# EAGLE schematic pick&place (EAGLE 9.4.2)
CNAME: Pick&Place; CREVISION: 1.0 - 032021; DESIGNER: Mauro Alfieri
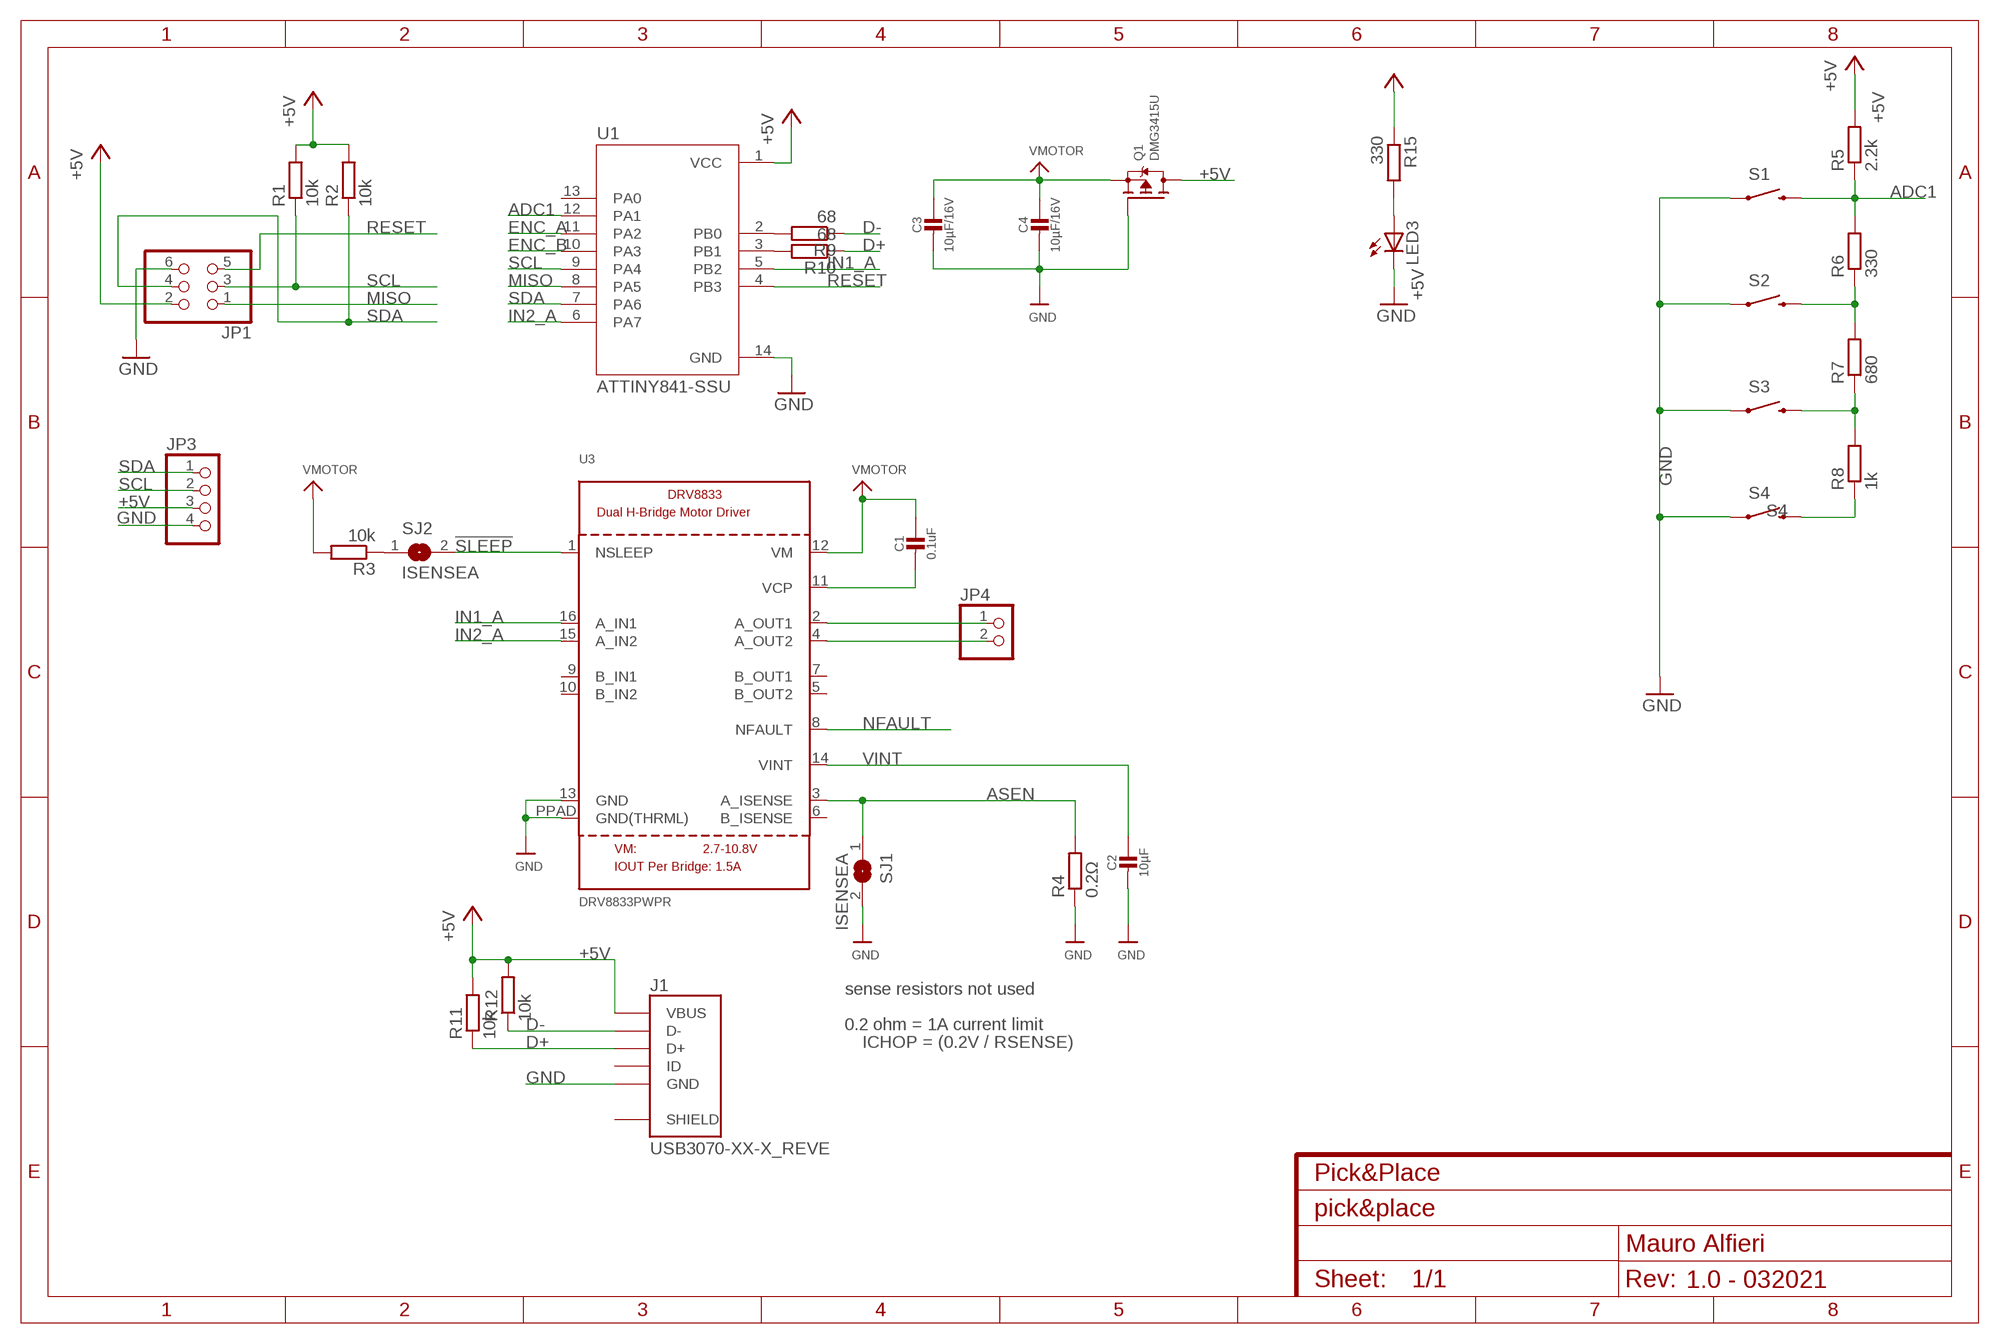
[diagram p0: schematic, sheet 1]

## Parts
C1  0.1uF  CAP_CERAMIC0805-NOOUTLINE  [0805-NO]
C2  10µF  CAP_CERAMIC0805-NOOUTLINE  [0805-NO]
C3  10µF/16V  CAP_CERAMIC0805-NOOUTLINE  [0805-NO]
C4  10µF/16V  CAP_CERAMIC0805-NOOUTLINE  [0805-NO]
J1  USB3070-XX-X_REVE  [GCT_USB3070-XX-X_REVE]
JP1  PINHD-2X3  [2X03]
JP3  HEADER-1X4ROUND  [1X04_ROUND]
JP4  HEADER-1X2ROUND  [1X02_ROUND]
LED3  LEDSML0805  [SML0805]
Q1  DMG3415U  MOSFET-PWIDE  [SOT23-WIDE]
R1  10k  R-EU_R0805  [R0805]
R2  10k  R-EU_R0805  [R0805]
R3  10k  R-EU_R0805  [R0805]
R4  0.2Ω  R-EU_R0805  [R0805]
R5  2.2k  R-EU_R0805  [R0805]
R6  330  R-EU_R0805  [R0805]
R7  680  R-EU_R0805  [R0805]
R8  1k  R-EU_R0805  [R0805]
R9  68  R-EU_R0805  [R0805]
R10  68  R-EU_R0805  [R0805]
R11  10k  R-EU_R0805  [R0805]
R12  10k  R-EU_R0805  [R0805]
R15  330  R-EU_R0805  [R0805]
S1  Forward  SWITCH-MOMENTARY-2-SMD-1101NE  [TACTILE-SWITCH-1101NE]
S2  Backward  SWITCH-MOMENTARY-2-SMD-1101NE  [TACTILE-SWITCH-1101NE]
S3  Config  SWITCH-MOMENTARY-2-SMD-1101NE  [TACTILE-SWITCH-1101NE]
S4  SWITCH-MOMENTARY-2-SMD-1101NE  [TACTILE-SWITCH-1101NE]
SJ1  ISENSEA  SOLDERJUMPER  [SOLDERJUMPER_ARROW_NOPASTE]
SJ2  ISENSEA  SOLDERJUMPER  [SOLDERJUMPER_ARROW_NOPASTE]
U1  ATTINY841-SSU  [SOIC127P599X175-14N]
U3  DRV8833PWPR  DRV8833  [HTSSOP16]

## Nets
!SLEEP: SJ2.2 U3.1(NSLEEP)
+5V: J1.1(VBUS) JP1.2 JP3.3 Q1.3(D) R1.2 R2.2 R5.2 R11.2 R12.2 R15.1 U1.1(VCC)
ADC1: R5.1 R6.2 S1.P$2 U1.12(PA1)
AOUT1: JP4.1 U3.2(A_OUT1)
AOUT2: JP4.2 U3.4(A_OUT2)
ASEN: R4.2 SJ1.1 U3.3(A_ISENSE)
D+: J1.3(D+) R10.1 R11.1
D-: J1.2(D-) R9.1 R12.1
ENC_A: U1.11(PA2)
ENC_B: U1.10(PA3)
GND: C2.2 C3.2 C4.2 J1.5(GND) JP1.6 JP3.4 LED3.C Q1.1(G) R4.1 S1.P$1 S2.P$1 S3.P$1 S4.P$1 SJ1.2 U1.14(GND) U3.13(GND) U3.PPAD(GND(THRML))
IN1_A: U1.5(PB2) U3.16(A_IN1)
IN2_A: U1.6(PA7) U3.15(A_IN2)
MISO: JP1.1 U1.8(PA5)
N$1: R3.1 SJ2.1
N$3: R9.2 U1.2(PB0)
N$4: R10.2 U1.3(PB1)
N$8: C1.2 U3.11(VCP)
N$9: R7.1 R8.2 S3.P$2
N$12: LED3.A R15.2
N$14: R6.1 R7.2 S2.P$2
NFAULT: U3.8(NFAULT)
RESET: JP1.5 U1.4(PB3)
S4: R8.1 S4.P$2
SCL: JP1.3 JP3.2 R1.1 U1.9(PA4)
SDA: JP1.4 JP3.1 R2.1 U1.7(PA6)
VINT: C2.1 U3.14(VINT)
VMOTOR: C1.1 C3.1 C4.1 Q1.2(S) R3.2 U3.12(VM)
Unconnected: J1.4(ID) U1.13(PA0) U3.5(B_OUT2) U3.6(B_ISENSE) U3.7(B_OUT1) U3.9(B_IN1) U3.10(B_IN2)

## Notes on the sheet
- sense resistors not used
- 0.2 ohm = 1A current limit
- ICHOP = (0.2V / RSENSE)

## Power pins joined to a net without a drawn wire
SHIELD: J1.6(SHIELD) J1.7(SHIELD)

## Library data of the parts
C1-C4 = microbuilder:CAP_CERAMIC: Ceramic Capacitors For new designs, use the packages preceded by an '_' character since they are more reliable: The following footprints should be used on most boards: _0402 - Standard footprint for regular board layouts _0603 - Standard footprint for regular board layouts _0805 - Standard footprint for regular board layouts _1206 - Standard footprint for regular board layouts For extremely tight-pitch boards where space is at a premium, the following 'micro-pitch' footprints can be used (smaller pads, no silkscreen outline, etc.): _0402MP - Micro-pitch footprint for very dense/compact boards _0603MP - Micro-pitch footprint for very dense/compact boards _0805MP - Micro-pitch footprint for very dense/compact boards _1206MP - Micro-pitch footprint for very dense/compact boards
J1 = USB3070-XX-X_REVE:USB3070-XX-X_REVE: Micro USB Receptacle, Type B, Mid-Mount SMT, Right Angled, Bottom Mount, 1.0mm Offset, without Peg Check prices <https://pricing.snapeda.com/parts/USB3070-30-A/Global%20Connector%20Technology/view-part?ref=eda>; AVAILABILITY: Warning; DESCRIPTION: USB - micro B USB 2.0 Receptacle Connector 5 Position Board Edge, Cutout; Surface Mount, Right Angle; MF: Global Connector Technology; MP: USB3070-30-A; PACKAGE: None; PRICE: None; PURCHASE-URL: https://pricing.snapeda.com/search/part/USB3070-30-A/?ref=eda
JP1 = SparkFun:PINHD-2X3: PIN HEADER
JP3 = microbuilder:HEADER-1X4: PIN HEADER
JP4 = microbuilder:HEADER-1X2: PIN HEADER
LED3 = led:LED: LED OSRAM: - CHIPLED LG R971, LG N971, LY N971, LG Q971, LY Q971, LO R971, LY R971 LH N974, LH R974 LS Q976, LO Q976, LY Q976 LO Q996 - Hyper CHIPLED LW Q18S LB Q993, LB Q99A, LB R99A - SideLED LS A670, LO A670, LY A670, LG A670, LP A670 LB A673, LV A673, LT A673, LW A673 LH A674 LY A675 LS A676, LA A676, LO A676, LY A676, LW A676 LS A679, LY A679, LG A679 - Hyper Micro SIDELED® LS Y876, LA Y876, LO Y876, LY Y876 LT Y87S - SmartLED LW L88C, LW L88S LB L89C, LB L89S, LG L890 LS L89K, LO L89K, LY L89K LS L896, LA L896, LO L896, LY L896 - TOPLED LS T670, LO T670, LY T670, LG T670, LP T670 LSG T670, LSP T670, LSY T670, LOP T670, LYG T670 LG T671, LOG T671, LSG T671 LB T673, LV T673, LT T673, LW T673 LH T674 LS T676, LA T676, LO T676, LY T676, LB T676, LH T676, LSB T676, LW T676 LB T67C, LV T67C, LT T67C, LS T67K, LO T67K, LY T67K, LW E67C LS E67B, LA E67B, LO E67B, LY E67B, LB E67C, LV E67C, LT E67C LW T67C LS T679, LY T679, LG T679 LS T770, LO T770, LY T770, LG T770, LP T770 LB T773, LV T773, LT T773, LW T773 LH T774 LS E675, LA E675, LY E675, LS T675 LS T776, LA T776, LO T776, LY T776, LB T776 LHGB T686 LT T68C, LB T68C - Hyper Mini TOPLED® LB M676 - Mini TOPLED Santana® LG M470 LS M47K, LO M47K, LY M47K Source: http://www.osram.convergy.de LUXEON: - LUMILED® LXK2-PW12-R00, LXK2-PW12-S00, LXK2-PW14-U00, LXK2-PW14-V00 LXK2-PM12-R00, LXK2-PM12-S00, LXK2-PM14-U00 LXK2-PE12-Q00, LXK2-PE12-R00, LXK2-PE12-S00, LXK2-PE14-T00, LXK2-PE14-U00 LXK2-PB12-K00, LXK2-PB12-L00, LXK2-PB12-M00, LXK2-PB14-N00, LXK2-PB14-P00, LXK2-PB14-Q00 LXK2-PR12-L00, LXK2-PR12-M00, LXK2-PR14-Q00, LXK2-PR14-R00 LXK2-PD12-Q00, LXK2-PD12-R00, LXK2-PD12-S00 LXK2-PH12-R00, LXK2-PH12-S00 LXK2-PL12-P00, LXK2-PL12-Q00, LXK2-PL12-R00 Source: www.luxeon.com KINGBRIGHT: KA-3528ASYC Source: www.kingbright.com
Q1 = microbuilder:MOSFET-P: P-Channel Mosfet LEGEND VDS: Voltage Drain-Source ID: Drain Current RDS(ON): Drain-Source On-State Resistance VGS(TH): Gate-Source Threshold Voltage CISS: Drain-Source Input Capacitance SOT-23 Name VDS ID RDS(ON) VGS(TH) CISS Order Number IRLML5103 30V 760mA 600 mOhm -- 75pF @ 25V Digikey: IRLML5103PBFCT-ND IRLML6401 12V 4.3A 50 mOhm 950mV @ 250µA 830pF @ 10V Digikey: IRLML6401PBFTR-ND NTR0202PL 20V 400mA 800 mOhm 2.3V @ 250uA 70pF @ 5V Digikey: NTR0202PLT1GOSTR-ND NTR4101PT1G 20V 1.8A 85 mOhm 1.2V @ 250uA 675pF @ 10V Digikey: NTR4101PT1GOSCT-ND DMP2004K 20V 600mA 900 mOhm 1V @ 250uA 175pF @ 16V Digikey: DMP2004KDICT-ND PMV65XP 20V 3.9A 76 mOhm 950mV @ 1mA 725pF @ 20V Digikey: 568-2358-2-ND TO-252 Name VDS ID RDS(ON) VGS(TH) CISS Order Number AOD417 30V 25A 34 mOhm 3V @ 250µA 920pF @ 15V Digikey: 785-1106-2-ND
R1-R12 R15 = rcl:R-EU_: RESISTOR, European symbol
S1-S4 = SparkFun:SWITCH-MOMENTARY-2
SJ1 SJ2 = microbuilder:SOLDERJUMPER: SMD Solder JUMPER Solder the two pads together to create a connection, or remove the solder to break it. REFLOW - Use this footprint for solder paste and reflow ovens. WAVE - Use this footprint for hand-soldering (larger pads). CLOSED - Has a trace between the two pads to ensure it is closed by default. The trace needs to be cut to disable the jumper, and can be closed again by creating a solder bridge between the two pads.; BOM: EXCLUDE
U1 = ATTINY841-SSU:ATTINY841-SSU: MCU 8-bit ATtiny AVR CISC 8KB Flash 1.8V/2.5V/3.3V/5V 14-Pin SOIC W Tray Check prices <https://pricing.snapeda.com/parts/ATTINY841-SSU/Microchip/view-part?ref=eda>; AVAILABILITY: Good; DESCRIPTION: AVR AVR® ATtiny Microcontroller IC 8-Bit 16MHz 8KB (8K x 8) FLASH 14-SOIC; MF: Microchip; MP: ATTINY841-SSU; PACKAGE: SOIC-14 Microchip; PRICE: None; PURCHASE-URL: https://pricing.snapeda.com/search/part/ATTINY841-SSU/?ref=eda
U3 = microbuilder:DRV8833: DRV8833 Dual H-Bridge Motor Driver -- HTSSOP Package

## Net classes
2 gnd: width 0.254 mm, drill 0.356 mm, clearance 0.127 mm